# Altium schematic sheet SH09-PWR2.SchDoc
size A4
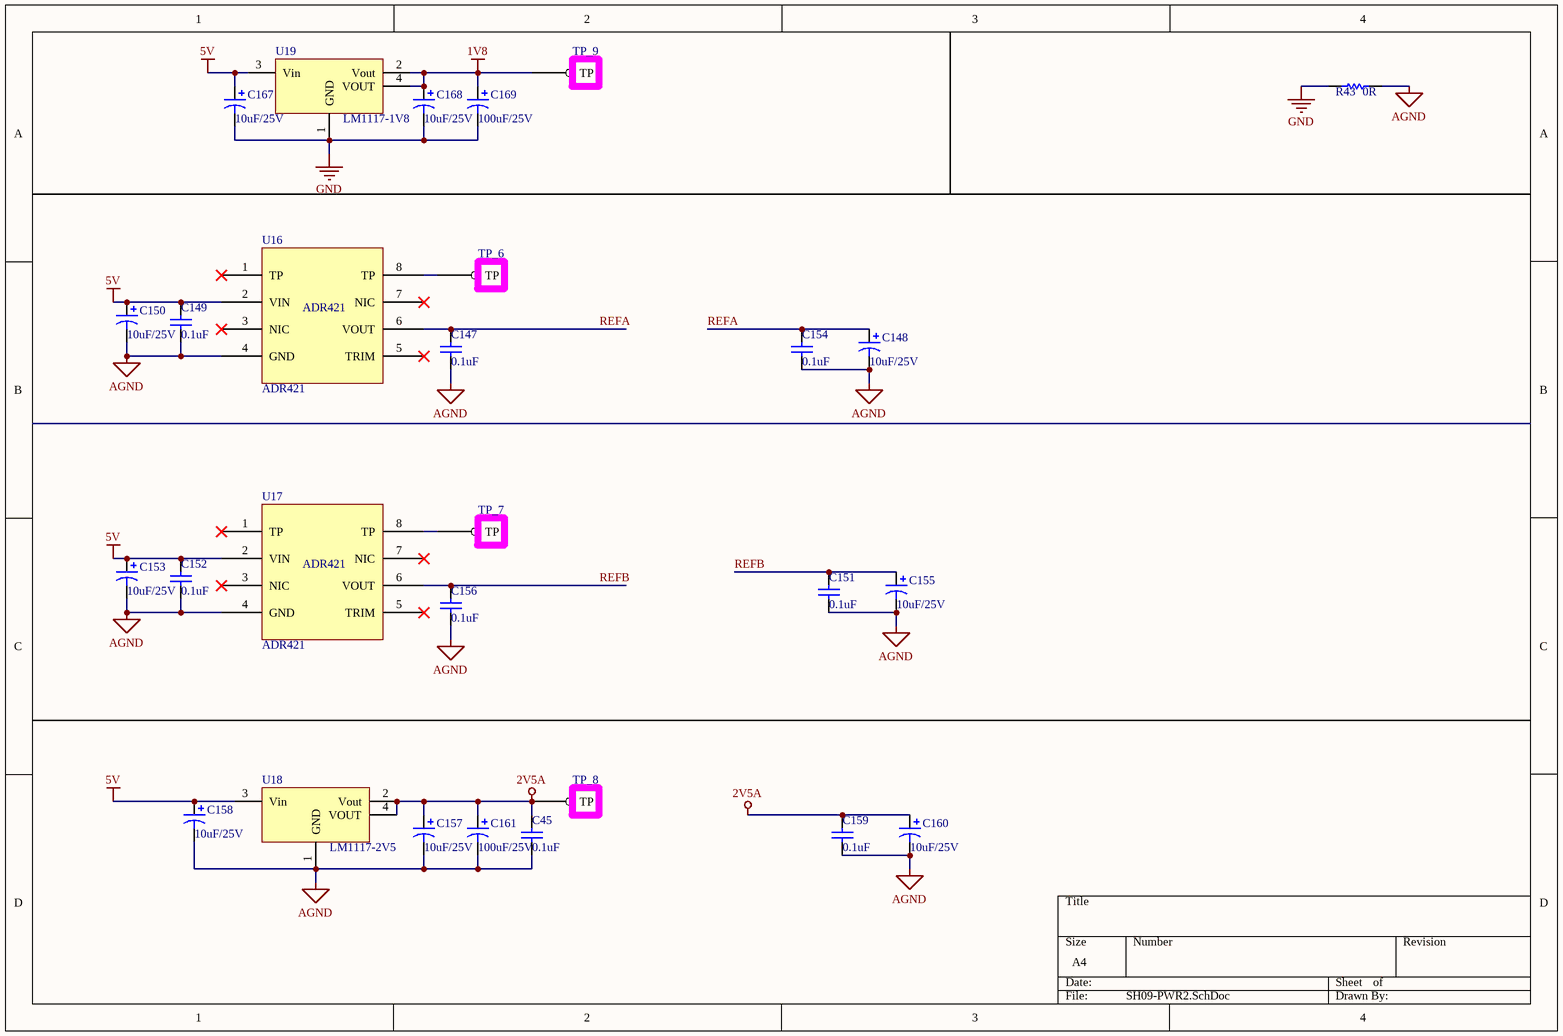
[diagram p0: SH09-PWR2.SchDoc]

## Parts
C45  value 0.1uF  [1608[0603]]  (hidden comment: Cap,0.1uF/0603)
C147  value 0.1uF  [1608[0603]]  (hidden comment: Cap,0.1uF/0603)
C148  value 10uF/25V  [1206[3216]]  (hidden comment: Cap Pol,10uF/25V,1206)
C149  value 0.1uF  [1608[0603]]  (hidden comment: Cap,0.1uF/0603)
C150  value 10uF/25V  [1206[3216]]  (hidden comment: Cap Pol,10uF/25V,1206)
C151  value 0.1uF  [1608[0603]]  (hidden comment: Cap,0.1uF/0603)
C152  value 0.1uF  [1608[0603]]  (hidden comment: Cap,0.1uF/0603)
C153  value 10uF/25V  [1206[3216]]  (hidden comment: Cap Pol,10uF/25V,1206)
C154  value 0.1uF  [1608[0603]]  (hidden comment: Cap,0.1uF/0603)
C155  value 10uF/25V  [1206[3216]]  (hidden comment: Cap Pol,10uF/25V,1206)
C156  value 0.1uF  [1608[0603]]  (hidden comment: Cap,0.1uF/0603)
C157  value 10uF/25V  [1206[3216]]  (hidden comment: Cap Pol,10uF/25V,1206)
C158  value 10uF/25V  [1206[3216]]  (hidden comment: Cap Pol,10uF/25V,1206)
C159  value 0.1uF  [1608[0603]]  (hidden comment: Cap,0.1uF/0603)
C160  value 10uF/25V  [1206[3216]]  (hidden comment: Cap Pol,10uF/25V,1206)
C161  value 100uF/25V  [1210[3528]]  (hidden comment: Cap Pol,100uF/25V,1210)
C167  value 10uF/25V  [1206[3216]]  (hidden comment: Cap Pol,10uF/25V,1206)
C168  value 10uF/25V  [1206[3216]]  (hidden comment: Cap Pol,10uF/25V,1206)
C169  value 100uF/25V  [1210[3528]]  (hidden comment: Cap Pol,100uF/25V,1210)
R43  value 0R  [2012[0805]]  (hidden comment: Res,0R/0805)
TP_6  REFA  [MYTP]  (value not drawn)
TP_7  REFB  [MYTP]  (value not drawn)
TP_8  2V5  [MYTP]  (value not drawn)
TP_9  1V8  [MYTP]  (value not drawn)
U16  ADR421  [SOIC127P600X175-8N]
U17  ADR421  [SOIC127P600X175-8N]
U18  LM1117-2V5  [SOT223P700X180-4N]
U19  LM1117-1V8  [SOT223P700X180-4N]

## Nets
1V8: C168.1 C169.1 TP_9.1(TP) U19.2(Vout) U19.4(VOUT)
2V5A: C45.1 C157.1 C159.1 C160.1 C161.1 TP_8.1(TP) U18.2(Vout) U18.4(VOUT)
5V: C149.1 C150.1 C152.1 C153.1 C158.1 C167.1 U16.2(VIN) U17.2(VIN) U18.3(Vin) U19.3(Vin)
AGND: C45.2 C147.2 C148.2 C149.2 C150.2 C151.2 C152.2 C153.2 C154.2 C155.2 C156.2 C157.2 C158.2 C159.2 C160.2 C161.2 R43.1 U16.4(GND) U17.4(GND) U18.1(GND)
GND: C167.2 C168.2 C169.2 R43.2 U19.1(GND)
REFA: C147.1 C148.1 C154.1 U16.6(VOUT)
REFB: C151.1 C155.1 C156.1 U17.6(VOUT)
NetTP_6_1: TP_6.1(TP) U16.8(TP)
NetTP_7_1: TP_7.1(TP) U17.8(TP)

Not connected (* = marked no-connect by the designer): U16 1(TP)* 3(NIC)* 5(TRIM)* 7(NIC)*; U17 1(TP)* 3(NIC)* 5(TRIM)* 7(NIC)*

## Library data of the parts
C45 C147 C149 C151 C152 C154 C156 C159 = Cap: Capacitor; Published: 8-Jun-2000; LatestRevisionDate: 17-Jul-2002; LatestRevisionNote: Re-released for DXP Platform.; PackageReference: RAD-0.3; Publisher: Altium Limited
C148 C150 C153 C155 C157 C158 C160 C161 C167-C169 = Cap Pol1: Polarized Capacitor (Radial); Published: 8-Jun-2000; LatestRevisionDate: 17-Jul-2002; LatestRevisionNote: Re-released for DXP Platform.; PackageReference: RB7.6-15; Publisher: Altium Limited
R43 = Res1: Resistor; Published: 8-Jun-2000; LatestRevisionDate: 17-Jul-2002; LatestRevisionNote: Re-released for DXP Platform.; PackageReference: AXIAL-0.3; Publisher: Altium Limited
TP_6-TP_9 = TEST POINT_0: Right: 10; Bottom: 20
U16 U17 = PWR_ADR421: Ultraprecision Low Noise, 2.048 V/2.500 V/  3.00 V/5.00 V XFET? Voltage References
U18 U19 = VOLTREG